# EAGLE design PowerGlove_DueShield (EAGLE 8.3.0)
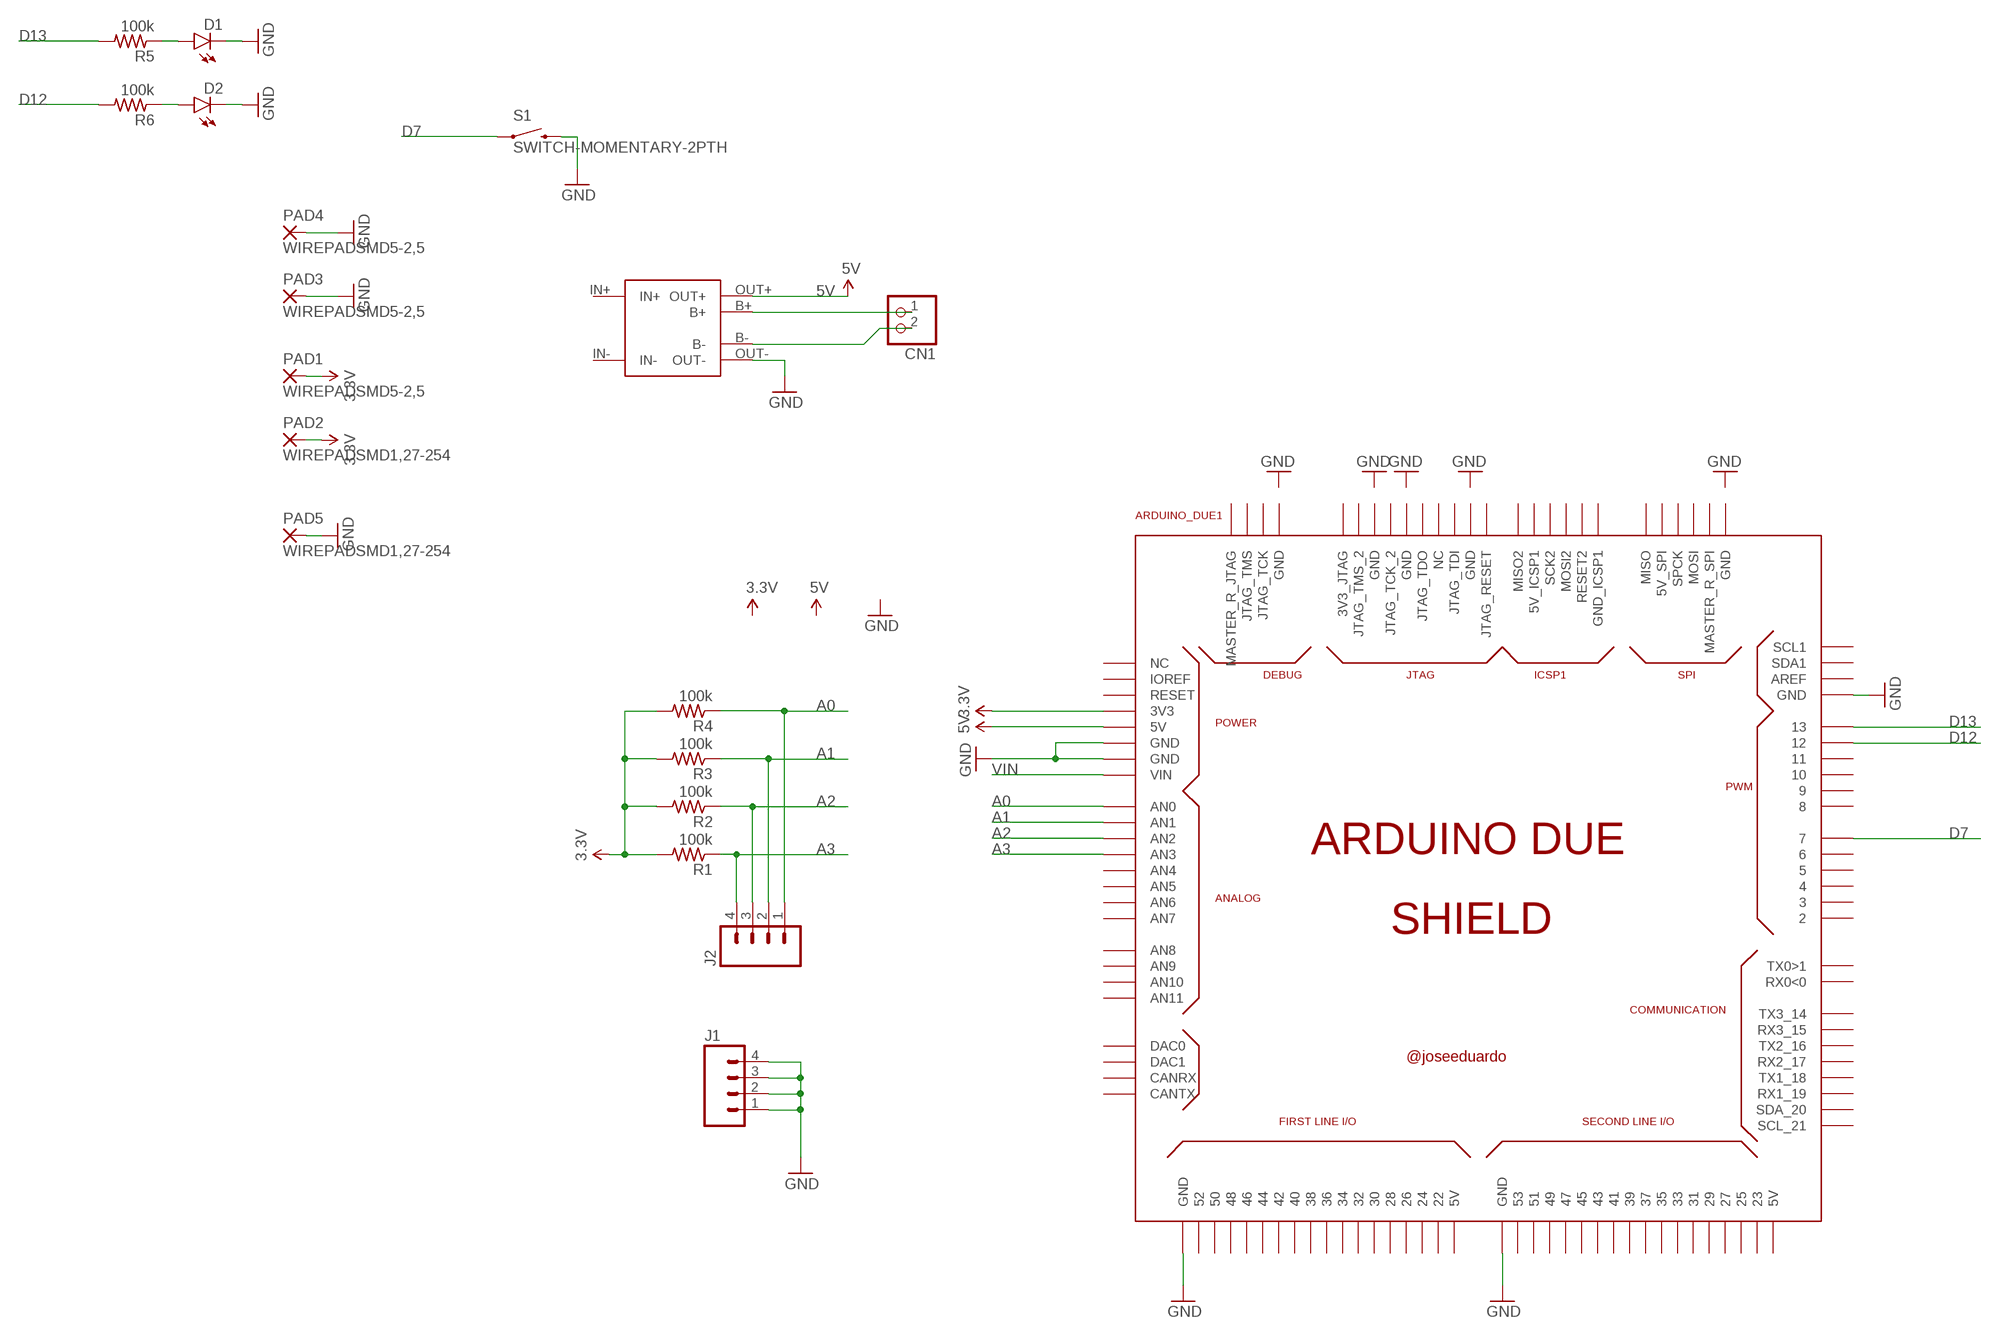
[diagram p0: schematic, sheet 1]

## Parts
ARDUINO_DUE1  ARDUINO_DUE_SHIELD  [ARDUINO_DUE_SHIELD]
CN1  JST_2PIN-THM-RA  [JST-PH-2-THM-RA]
D1  LED3MM  [LED3MM]
D2  LED3MM  [LED3MM]
J1  M04LONGPADS  [1X04_LONGPADS]
J2  M04LONGPADS  [1X04_LONGPADS]
PAD1  WIREPADSMD5-2,5  [5-2,5]
PAD2  WIREPADSMD1,27-254  [SMD1,27-2,54]
PAD3  WIREPADSMD5-2,5  [5-2,5]
PAD4  WIREPADSMD5-2,5  [5-2,5]
PAD5  WIREPADSMD1,27-254  [SMD1,27-2,54]
R1  100k  R-US_0207/10  [0207/10]
R2  100k  R-US_0207/10  [0207/10]
R3  100k  R-US_0207/10  [0207/10]
R4  100k  R-US_0207/10  [0207/10]
R5  100k  R-US_0207/10  [0207/10]
R6  100k  R-US_0207/10  [0207/10]
S1  SWITCH-MOMENTARY-2PTH  [TACTILE-PTH]
U$1  TP4056-MODULE  [TP4056-LITHIUM-PROTECTED-MODULE]

## Nets
3.3V: ARDUINO_DUE1.3V3 PAD1.1(P) PAD2.1(P) R1.2 R2.2 R3.2 R4.2
5V: ARDUINO_DUE1.5V0(5V) U$1.OUT+
A0: ARDUINO_DUE1.A0(AN0) J2.1 R4.1
A1: ARDUINO_DUE1.A1(AN1) J2.2 R3.1
A2: ARDUINO_DUE1.A2(AN2) J2.3 R2.1
A3: ARDUINO_DUE1.A3(AN3) J2.4 R1.1
B+: CN1.1 U$1.B+
B-: CN1.2 U$1.B-
D7: ARDUINO_DUE1.7 S1.1
D12: ARDUINO_DUE1.12 R6.2
D13: ARDUINO_DUE1.13 R5.2
GND: ARDUINO_DUE1.GND ARDUINO_DUE1.GND_1(GND) ARDUINO_DUE1.GND_2(GND) ARDUINO_DUE1.GND_3(GND) ARDUINO_DUE1.GND_4(GND) D1.K(C) D2.K(C) J1.1 J1.2 J1.3 J1.4 PAD3.1(P) PAD4.1(P) PAD5.1(P) S1.3 U$1.OUT-
N$1: D1.A R5.1
N$2: D2.A R6.1
VIN: ARDUINO_DUE1.VIN
Unconnected: ARDUINO_DUE1.0(RX0<0) ARDUINO_DUE1.1(TX0>1) ARDUINO_DUE1.2 ARDUINO_DUE1.3 ARDUINO_DUE1.3V3_JTAG ARDUINO_DUE1.4 ARDUINO_DUE1.5 ARDUINO_DUE1.5V0_1(5V) ARDUINO_DUE1.5V0_2(5V) ARDUINO_DUE1.5V_2(5V_SPI) ARDUINO_DUE1.5V_ICSP1 ARDUINO_DUE1.6 ARDUINO_DUE1.8 ARDUINO_DUE1.9 ARDUINO_DUE1.10 ARDUINO_DUE1.11 ARDUINO_DUE1.14(TX3_14) ARDUINO_DUE1.15(RX3_15) ARDUINO_DUE1.16(TX2_16) ARDUINO_DUE1.17(RX2_17) ARDUINO_DUE1.18(TX1_18) ARDUINO_DUE1.19(RX1_19) ARDUINO_DUE1.20(SDA_20) ARDUINO_DUE1.21(SCL_21) ARDUINO_DUE1.22 ARDUINO_DUE1.23 ARDUINO_DUE1.24 ARDUINO_DUE1.25 ARDUINO_DUE1.26 ARDUINO_DUE1.27 ARDUINO_DUE1.28 ARDUINO_DUE1.29 ARDUINO_DUE1.30 ARDUINO_DUE1.31 ARDUINO_DUE1.32 ARDUINO_DUE1.33 ARDUINO_DUE1.34 ARDUINO_DUE1.35 ARDUINO_DUE1.36 ARDUINO_DUE1.37 ARDUINO_DUE1.38 ARDUINO_DUE1.39 ARDUINO_DUE1.40 ARDUINO_DUE1.41 ARDUINO_DUE1.42 ARDUINO_DUE1.43 ARDUINO_DUE1.44 ARDUINO_DUE1.45 ARDUINO_DUE1.46 ARDUINO_DUE1.47 ARDUINO_DUE1.48 ARDUINO_DUE1.49 ARDUINO_DUE1.50 ARDUINO_DUE1.51 ARDUINO_DUE1.52 ARDUINO_DUE1.53 ARDUINO_DUE1.A4(AN4) ARDUINO_DUE1.A5(AN5) ARDUINO_DUE1.A6(AN6) ARDUINO_DUE1.A7(AN7) ARDUINO_DUE1.A8(AN8) ARDUINO_DUE1.A9(AN9) ARDUINO_DUE1.A10(AN10) ARDUINO_DUE1.A11(AN11) ARDUINO_DUE1.AREF ARDUINO_DUE1.CANRX ARDUINO_DUE1.CANTX ARDUINO_DUE1.DAC0 ARDUINO_DUE1.DAC1 ARDUINO_DUE1.GND_5(GND) ARDUINO_DUE1.GND_7(GND) ARDUINO_DUE1.GND_8(GND) ARDUINO_DUE1.GND_9(GND) ARDUINO_DUE1.GND_10(GND) ARDUINO_DUE1.GND_ICSP1 ARDUINO_DUE1.IOREF ARDUINO_DUE1.JTAG_RESET ARDUINO_DUE1.JTAG_TCK ARDUINO_DUE1.JTAG_TCK_2 ARDUINO_DUE1.JTAG_TDI ARDUINO_DUE1.JTAG_TDO ARDUINO_DUE1.JTAG_TMS ARDUINO_DUE1.JTAG_TMS_2 ARDUINO_DUE1.MASTER_RESET_JTAG(MASTER_R_JTAG) ARDUINO_DUE1.MASTER_RESET_SPI(MASTER_R_SPI) ARDUINO_DUE1.MISO ARDUINO_DUE1.MISO2 ARDUINO_DUE1.MOSI ARDUINO_DUE1.MOSI2 ARDUINO_DUE1.NC_2(NC) ARDUINO_DUE1.NC_5(NC) ARDUINO_DUE1.RESET ARDUINO_DUE1.RESET2 ARDUINO_DUE1.SCK2 ARDUINO_DUE1.SCL1 ARDUINO_DUE1.SDA1 ARDUINO_DUE1.SPCK

## Power pins joined to a net without a drawn wire
IN+: U$1.IN+
IN-: U$1.IN-

## Library data of the parts
ARDUINO_DUE1 = arduino_due_shield:ARDUINO_DUE_SHIELD
CN1 = adafruit:JST_2PIN: JST 2-Pin Connectors of various flavors SMT-RA (S2B-PH-SM4) 4UConnector #17311 SMT (B2B-PH-SM4) THM-RA (S2B-PH) THM (B2B-PH)
D1 D2 = SparkFun-LED:LED: LEDs Standard schematic elements and footprints for 5mm, 3mm, 1206, and 0603 sized LEDs. 5mm - Spark Fun Electronics SKU : COM-00529 (and others); PROD_ID: DIO-08794
J1 J2 = SparkFun-Connectors:M04: Header 4 Standard 4-pin 0.1" header. Use with straight break away headers (SKU : PRT-00116), right angle break away headers (PRT-00553), swiss pins (PRT-00743), machine pins (PRT-00117), and female headers (PRT-00115). Molex polarized connector foot print use with SKU : PRT-08231 with associated crimp pins and housings. 1MM SMD Version SKU: PRT-10208; PROD_ID: CONN-09696
PAD1-PAD5 = wirepad:WIREPAD: Wire PAD connect wire on PCB
R1-R6 = adafruit:R-US_: RESISTOR, American symbol
S1 = SparkFun-Electromechanical:SWITCH-MOMENTARY-2: Various NO switches- pushbuttons, reed, etc; PROD_ID: SWCH-08441
U$1 = userlib:TP4056-MODULE

## Board
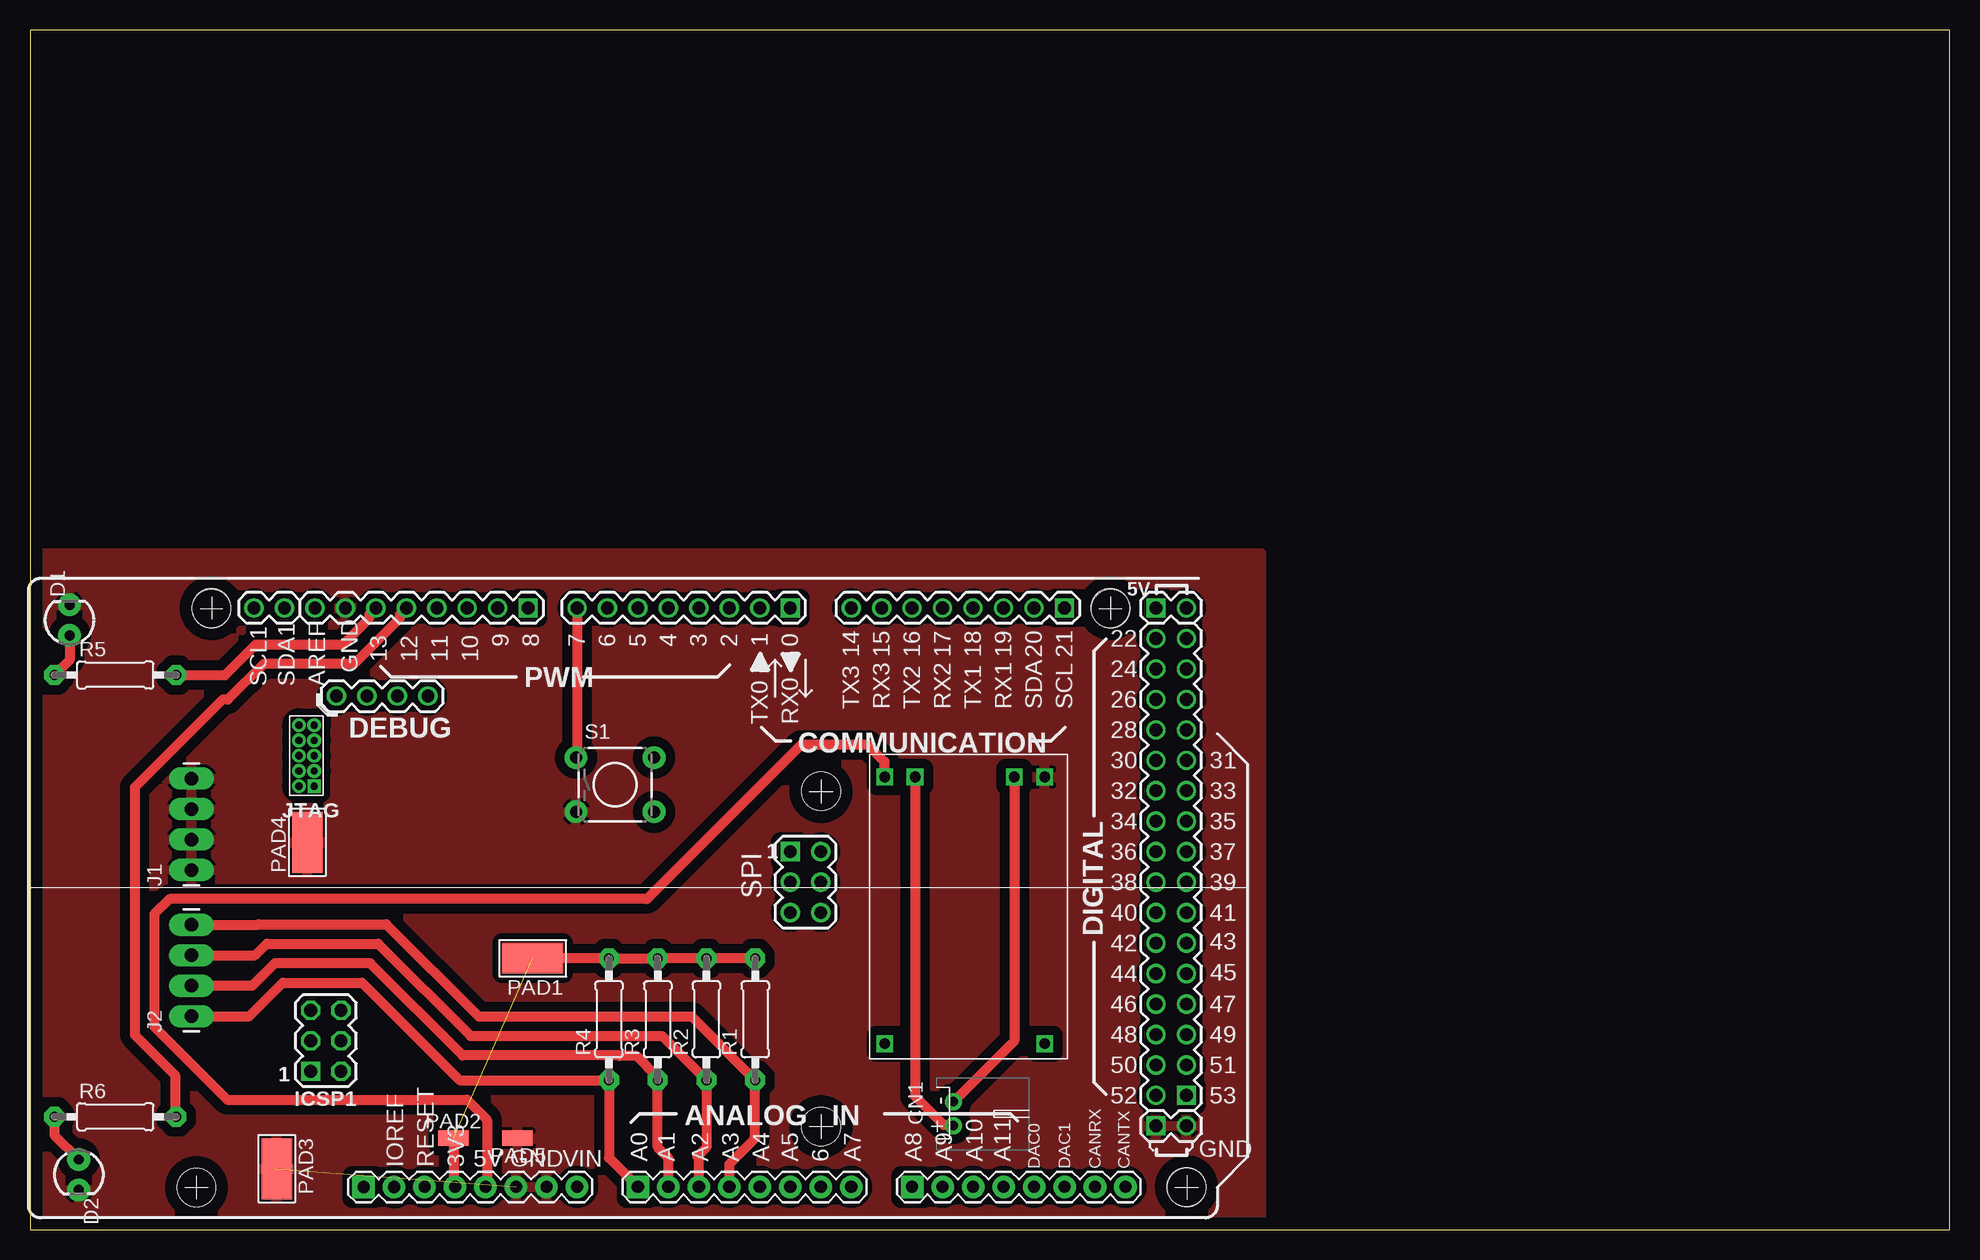
[diagram p1: board, top side]
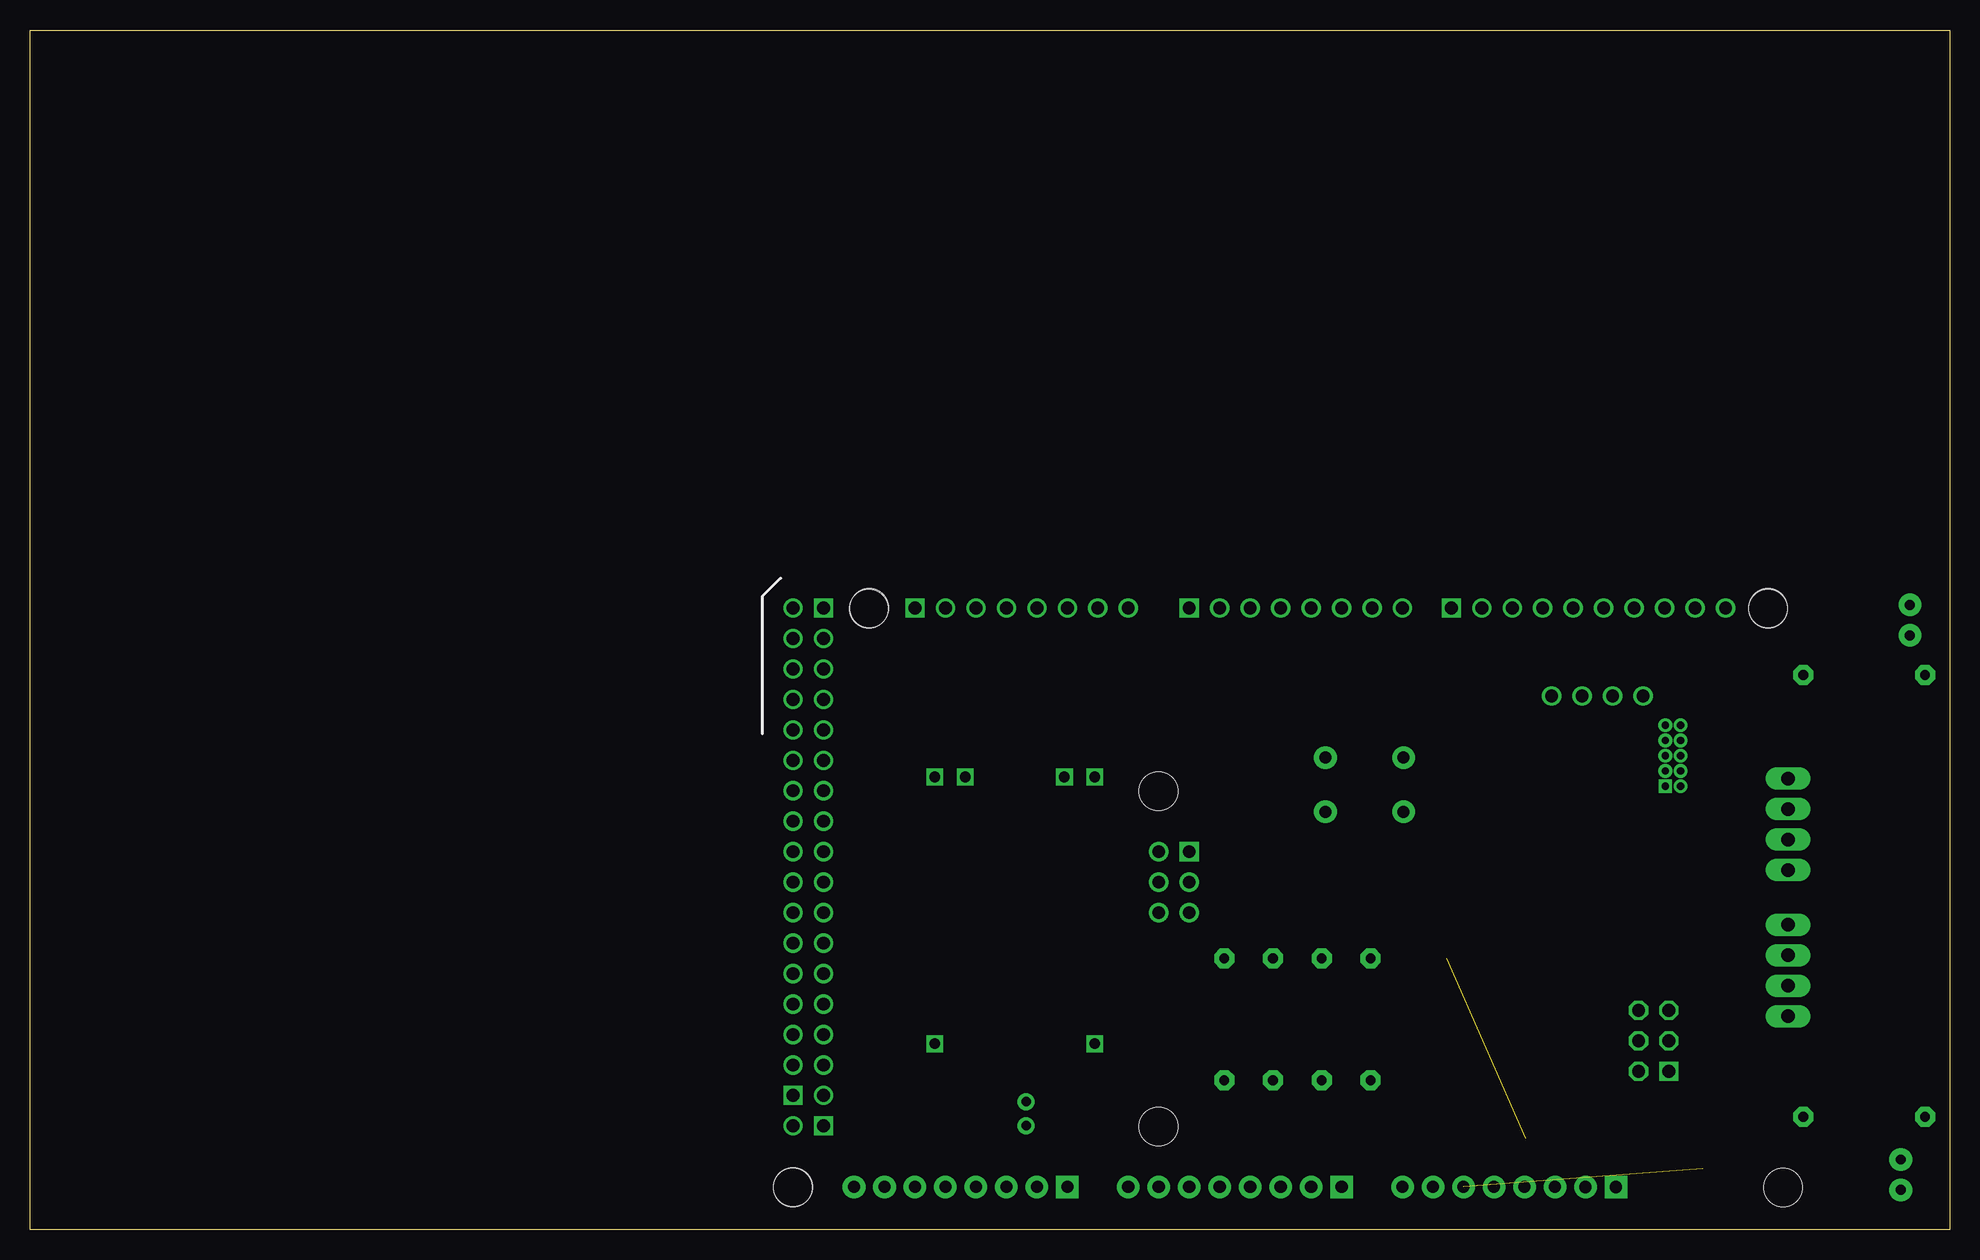
[diagram p2: board, bottom side, seen from below]

Size 160 x 100 mm. Coordinates in mm from the lower left corner, seen from the top.
Outline: 0,0 160,0 160,100 0,100 0,0
Copper layers (1*16): Top 0.035mm / dielectric 1.5mm / Bottom 0.035mm
Design rules "default *": minimum track width 6mil, minimum drill 0.35mm, track to track 32mil, track to pad 32mil, pad to pad 32mil, via to via 32mil, smd to smd 6mil, copper to edge 40mil, drill to drill 6mil, minimum pad ring 10mil, minimum via ring 8mil, stop-mask expansion 4mil, vias tented up to drill 0mil, thermal gap 10mil

### Footprints (pad centres in the part's own frame; a part is rotated, then mirrored left to right if it is on the bottom)
ARDUINO_DUE_SHIELD = drill 1.067 square: 0 63.373,51.816; 5V0_1 93.853,51.816; 8 41.529,51.816; 21 86.233,51.816; 53 96.393,11.176; GND_2 93.853,8.636; MISO 63.373,31.496; MISO2 23.384,13.196 | drill 1.067: 1 60.833,51.816; 2 58.293,51.816; 3 55.753,51.816; 4 53.213,51.816; 5 50.673,51.816; 5V0_2 96.393,51.816; 5V_2 65.913,31.496; 6 48.133,51.816; 7 45.593,51.816; 9 38.989,51.816; 10 36.449,51.816; 11 33.909,51.816; 12 31.369,51.816; 13 28.829,51.816; 14 68.453,51.816; 15 70.993,51.816; 16 73.533,51.816; 17 76.073,51.816; 18 78.613,51.816; 19 81.153,51.816; 20 83.693,51.816; 22 93.853,49.276; 23 96.393,49.276; 24 93.853,46.736; 25 96.393,46.736; 26 93.853,44.196; 27 96.393,44.196; 28 93.853,41.656; 29 96.393,41.656; 30 93.853,39.116; 31 96.393,39.116; 32 93.853,36.576; 33 96.393,36.576; 34 93.853,34.036; 35 96.393,34.036; 36 93.853,31.496; 37 96.393,31.496; 38 93.853,28.956; 39 96.393,28.956; 40 93.853,26.416; 41 96.393,26.416; 42 93.853,23.876; 43 96.393,23.876; 44 93.853,21.336; 45 96.393,21.336; 46 93.853,18.796; 47 96.393,18.796; 48 93.853,16.256; 49 96.393,16.256; 50 93.853,13.716; 51 96.393,13.716; 52 93.853,11.176; AREF 23.749,51.816; GND_3 96.393,8.636; GND_4 26.289,51.816; GND_5 65.913,26.416; GND_7 33.161,44.473; JTAG_TCK 30.621,44.473; JTAG_TMS 28.081,44.473; MASTER_RESET_JTAG 25.541,44.473; MASTER_RESET_SPI 63.373,26.416; MOSI 65.913,28.956; SCL1 18.669,51.816; SDA1 21.209,51.816; SPCK 63.373,28.956 | drill 1.016 pad 1.88: 3V3 35.433,3.556; 5V0 37.973,3.556; A1 53.213,3.556; A2 55.753,3.556; A3 58.293,3.556; A4 60.833,3.556; A5 63.373,3.556; A6 65.913,3.556; A7 68.453,3.556; A9 76.073,3.556; A10 78.613,3.556; A11 81.153,3.556; CANRX 88.773,3.556; CANTX 91.313,3.556; DAC0 83.693,3.556; DAC1 86.233,3.556; GND 40.513,3.556; GND_1 43.053,3.556; IOREF 30.346,3.543; RESET 32.893,3.555; VIN 45.593,3.556 | drill 0.6 pad 1.016 square: 3V3_JTAG 23.689,36.964 | drill 1.067 octagon: 5V_ICSP1 25.924,13.196; GND_ICSP1 25.924,18.276; MOSI2 25.924,15.736; RESET2 23.384,18.276; SCK2 23.384,15.736 | drill 1.016 pad 1.88 square: A0 50.673,3.556; A8 73.533,3.556; NC_2 27.806,3.543 | drill 0.6 pad 1.143: GND_8 23.689,38.234; GND_9 23.689,40.774; GND_10 23.689,42.044; JTAG_RESET 22.419,42.044; JTAG_TCK_2 22.419,38.234; JTAG_TDI 22.419,40.774; JTAG_TDO 22.419,39.504; JTAG_TMS_2 22.419,36.964; NC_5 23.689,39.504 | hole 3.2: 15.113,51.816; 90.043,51.816; 96.393,3.556; 96.418,3.505; 15.138,51.765; 90.068,51.765; 13.868,3.505; 65.938,36.525; 65.938,8.585
JST-PH-2-THM-RA = drill 0.8 pad 1.422: 1 1,0; 2 -1,0
LED3MM = drill 0.813 pad 1.88: A -1.27,0; K 1.27,0
1X04_LONGPADS = drill 1.118 pad 1.88 long: 1 0,0; 2 2.54,0; 3 5.08,0; 4 7.62,0
5-2,5 = smd 2.54 x 5.08: 1 0,0
SMD1,27-2,54 = smd 1.27 x 2.54: 1 0,0
0207/10 = drill 0.813 pad 1.676 octagon: 1 -5.08,0; 2 5.08,0
TACTILE-PTH = drill 1.016 pad 1.88: 1 -3.251,2.261; 2 3.251,2.261; 3 -3.251,-2.261; 4 3.251,-2.261
TP4056-LITHIUM-PROTECTED-MODULE = drill 0.9 square: B+ 10.795,4.445; B- 10.795,-3.81; IN+ -11.43,6.985; IN- -11.43,-6.35; OUT+ 10.795,6.985; OUT- 10.795,-6.35

### Placement (x,y rotation side)
ARDUINO_DUE1  0,0 0 top
CN1  76.96,9.65 270 top
D1  3.3,50.8 90 top
D2  4.06,4.57 270 top
J1  13.46,29.97 90 top
J2  13.46,17.78 90 top
PAD1  41.91,22.61 90 top
PAD2  35.31,7.62 270 top
PAD3  20.57,5.08 180 top
PAD4  23.11,32.26 0 top
PAD5  40.64,7.62 90 top
R1  60.45,17.53 90 top
R2  56.39,17.53 90 top
R3  52.32,17.53 90 top
R4  48.26,17.53 90 top
R5  7.11,46.23 0 top
R6  7.11,9.4 0 top
S1  48.77,37.08 0 top
U$1  78.23,26.92 90 top

### Tracks (layer width: path | path; a pad name or v marks a point on that pad's centre or on a via)
3.3V  (1 unrouted)
  Top 0.813: R1.2 R2.2 R3.2 R4.2 PAD1.1 | PAD2.1 35.31,3.68 ARDUINO_DUE1.3V3
5V
  Top 0.813: U$1.OUT+ 71.25,38.99 69.85,40.39 64.26,40.39 51.44,27.56 11.63,27.56 10.36,26.29 10.36,16.89 16.43,10.82 36.42,10.82 38.1,9.14 38.1,3.68 ARDUINO_DUE1.5V0
A0
  Top 0.813: J2.1 18.29,17.78 21.08,20.57 27.69,20.57 35.81,12.45 R4.1 48.26,5.97 ARDUINO_DUE1.A0
A1
  Top 0.813: J2.2 18.53,20.32 20.41,22.2 28.36,22.2 36.06,14.5 49.11,14.5 49.14,14.48 50.55,14.48 52.32,12.7 R3.1 52.32,6.86 53.21,5.97 ARDUINO_DUE1.A1
A2
  Top 0.813: J2.3 18.77,22.86 19.73,23.82 29.03,23.82 36.73,16.13 52.7,16.13 R2.1 56.39,6.86 55.63,6.1 55.75,5.97 ARDUINO_DUE1.A2
A3
  Top 0.813: J2.4 19.01,25.4 19.06,25.45 29.71,25.45 37.4,17.75 55.14,17.75 R1.1 60.45,7.62 58.29,5.46 ARDUINO_DUE1.A3
B+
  Top 0.813: CN1.1 76.89,8.72 76.16,8.72 73.79,11.1 U$1.B+
B-
  Top 0.813: U$1.B- 82.04,15.73 CN1.2
D7
  Top 0.813: ARDUINO_DUE1.7 45.59,39.42 S1.1
D12
  Top 0.813: ARDUINO_DUE1.12 30.85,51.3 30.85,50.98 27.01,47.14 19.47,47.14 16.5,44.17 16.05,44.17 8.74,36.86 8.74,16.21 12.09,12.86 12.09,9.5 R6.2
D13
  Top 0.813: R5.2 16.26,46.23 18.8,48.77 26.1,48.77 28.31,50.98 28.31,51.3 ARDUINO_DUE1.13
GND  (1 unrouted)
  pour Top: -1.27,56.39 102.62,56.39 102.62,-1.27 -1.27,-1.27
N$1
  Top 0.813: D1.A 3.3,47.5 R5.1
N$2
  Top 0.813: R6.1 2.03,7.87 D2.A